# EAGLE schematic OneLedBlinkerWith100kPot (EAGLE 7.6.0)
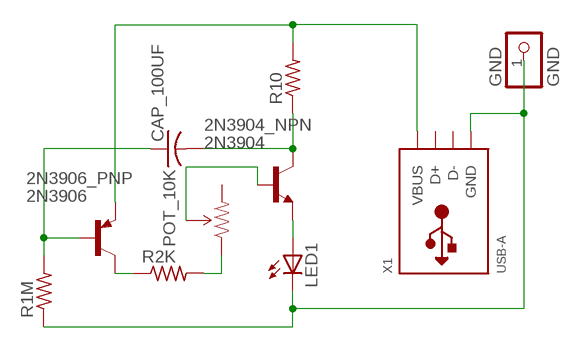
[diagram p0: schematic, sheet 1]

## Parts
2N3904_NPN  2N3904  [TO92]
2N3906_PNP  2N3906  [TO92]
CAP_100UF  C-US025-030X050  [C025-030X050]
GND  GND  PINHD-1X1  [1X01]
LED1  LED5MM  [LED5MM]
POT_10K  TRIMPOTPTH  [TRIM_POT_PTH]
R1M  R-US_0207/10  [0207/10]
R2K  R-US_0207/10  [0207/10]
R10  R-US_0207/10  [0207/10]
X1  USB-A  [MOLEX_480371000]

## Nets
N$1: 2N3906_PNP.3(E) R10.2 X1.1(VBUS)
N$2: 2N3904_NPN.1(C) CAP_100UF.2 R10.1
N$3: 2N3904_NPN.3(E) LED1.A
N$4: GND.1 LED1.K(C) R1M.1 X1.4(GND)
N$5: 2N3906_PNP.2(B) CAP_100UF.1 R1M.2
N$6: 2N3906_PNP.1(C) R2K.1
N$7: POT_10K.1(CCW) R2K.2
N$8: 2N3904_NPN.2(B) POT_10K.2(WIPER)
Unconnected: POT_10K.3(CW) X1.2(D-) X1.3(D+)

## Library data of the parts
2N3904_NPN = transistor:2N3904: NPN TRANSISTOR
2N3906_PNP = transistor-pnp:2N3906: PNP Transistor
CAP_100UF = adafruit:C-US: CAPACITOR, American symbol
GND = adafruit:PINHD-1X1: Pin header 1x1 for 0.1" spacing With round pins
LED1 = adafruit:LED: LED OSRAM: - CHIPLED LG R971, LG N971, LY N971, LG Q971, LY Q971, LO R971, LY R971 LH N974, LH R974 LS Q976, LO Q976, LY Q976 LO Q996 - Hyper CHIPLED LW Q18S LB Q993, LB Q99A, LB R99A - SideLED LS A670, LO A670, LY A670, LG A670, LP A670 LB A673, LV A673, LT A673, LW A673 LH A674 LY A675 LS A676, LA A676, LO A676, LY A676, LW A676 LS A679, LY A679, LG A679 - Hyper Micro SIDELED® LS Y876, LA Y876, LO Y876, LY Y876 LT Y87S - SmartLED LW L88C, LW L88S LB L89C, LB L89S, LG L890 LS L89K, LO L89K, LY L89K LS L896, LA L896, LO L896, LY L896 - TOPLED LS T670, LO T670, LY T670, LG T670, LP T670 LSG T670, LSP T670, LSY T670, LOP T670, LYG T670 LG T671, LOG T671, LSG T671 LB T673, LV T673, LT T673, LW T673 LH T674 LS T676, LA T676, LO T676, LY T676, LB T676, LH T676, LSB T676, LW T676 LB T67C, LV T67C, LT T67C, LS T67K, LO T67K, LY T67K, LW E67C LS E67B, LA E67B, LO E67B, LY E67B, LB E67C, LV E67C, LT E67C LW T67C LS T679, LY T679, LG T679 LS T770, LO T770, LY T770, LG T770, LP T770 LB T773, LV T773, LT T773, LW T773 LH T774 LS E675, LA E675, LY E675, LS T675 LS T776, LA T776, LO T776, LY T776, LB T776 LHGB T686 LT T68C, LB T68C - Hyper Mini TOPLED® LB M676 - Mini TOPLED Santana® LG M470 LS M47K, LO M47K, LY M47K Source: http://www.osram.convergy.de/
POT_10K = SparkFun-Electromechanical:TRIMPOT: Various small potentiometers for "set-and-forget" applications
R1M R2K R10 = adafruit:R-US_: RESISTOR, American symbol
X1 = adafruit:USB-A: USB type A 'plug' Used for things that can directly connect to a USB port, say USB key